# Altium schematic sheet power_supply.SchDoc
size A3; SheetNumber: 1; SheetTotal: 3; SPICEModelCacheKXPDIREM: <root> / <DocumentId>KXPDIREM</DocumentId> / <CacheFrame Number="0"> / <Model Name="amk105cbj106_v-f" Kind="CKT"> / <Text>* AMK105CBJ106_V-F     SPICE MODEL  ( General Type ) / *-------------------------------------------------------------------------------------------------------- / * Model Generated by TAIYO YUDEN Corporation (http://www.ty-top.com) / * Version 1.0 / * TAIYO YUDEN Control No. 170508_140220 / *-------------------------------------------------------------------------------------------------------- / * / * Products Name : Multilayer Ceramic Capacitors / * / * Characteristics : / *     Capacitance : 10 uF , Rated Voltage : 4.0V , TCC : X5R / *     Case Size : 1.0 x 0.5 / 0.039 x 0.02 [mm/inch] , Thickness : 0.5 / 0.02 [mm/inch] / *     (Conditions: Temperature = 25 degC , DC Bias Current/Voltage = 0A / 0V) / * / * Frequency Range : 40Hz - 3GHz / * / * External Node Assignments : / * / *  1  o---| |---o  2 / * / *-------------------------------------------------------------------------------------------------------- / .SubCkt AMK105CBJ106_V-F 1 2 / **************************** / C0 1 110 7.4107u / Cm 1 101 0.96702u / C1 101 102 0.739u / Rc1 101 102 366.75 / C2 102 103 0.24354u / Rc2 102 103 47.641 / C3 103 110 0.14706u / Rc3 103 110 4.2209 / C2m 1 301 1.7678u / C21 301 302 4.7117u / Rc21 301 302 845.67 / C22 302 303 4.121u / Rc22 302 303 734.55 / C23 303 304 4.3096u / Rc23 303 304 562.67 / C24 304 305 2.6992u / Rc24 304 305 26.221 / C25 305 306 1.2642u / Rc25 305 306 46.471 / C26 306 307 2.5266u / Rc26 306 307 22.579 / C27 307 308 0.76655u / Rc27 307 308 4.4337 / C28 308 309 0.64691u / Rc28 308 309 2.6063 / C29 309 110 4901.4p / Rc29 309 110 1.4662 / Rp0 1 110 10Meg / L0 110 120 0.1817n / Lm 120 130 0.19649n / L1 120 121 0.098105n / RL1 121 130 0.12128 / L2 120 122 0.12674n / RL2 122 130 0.26881 / L3 120 123 0.76569n / RL3 123 130 0.47843m / CR 120 124 1.5221u / LR 124 125 0.35836n / RR 125 130 25.315m / CL 130 140 2.9027p / LL 130 140 0.10763n / RL 130 140 26.768 / Rs 140 2 2.766m / **************************** / .ends</Text> / </Model> / </CacheFrame> / </root>
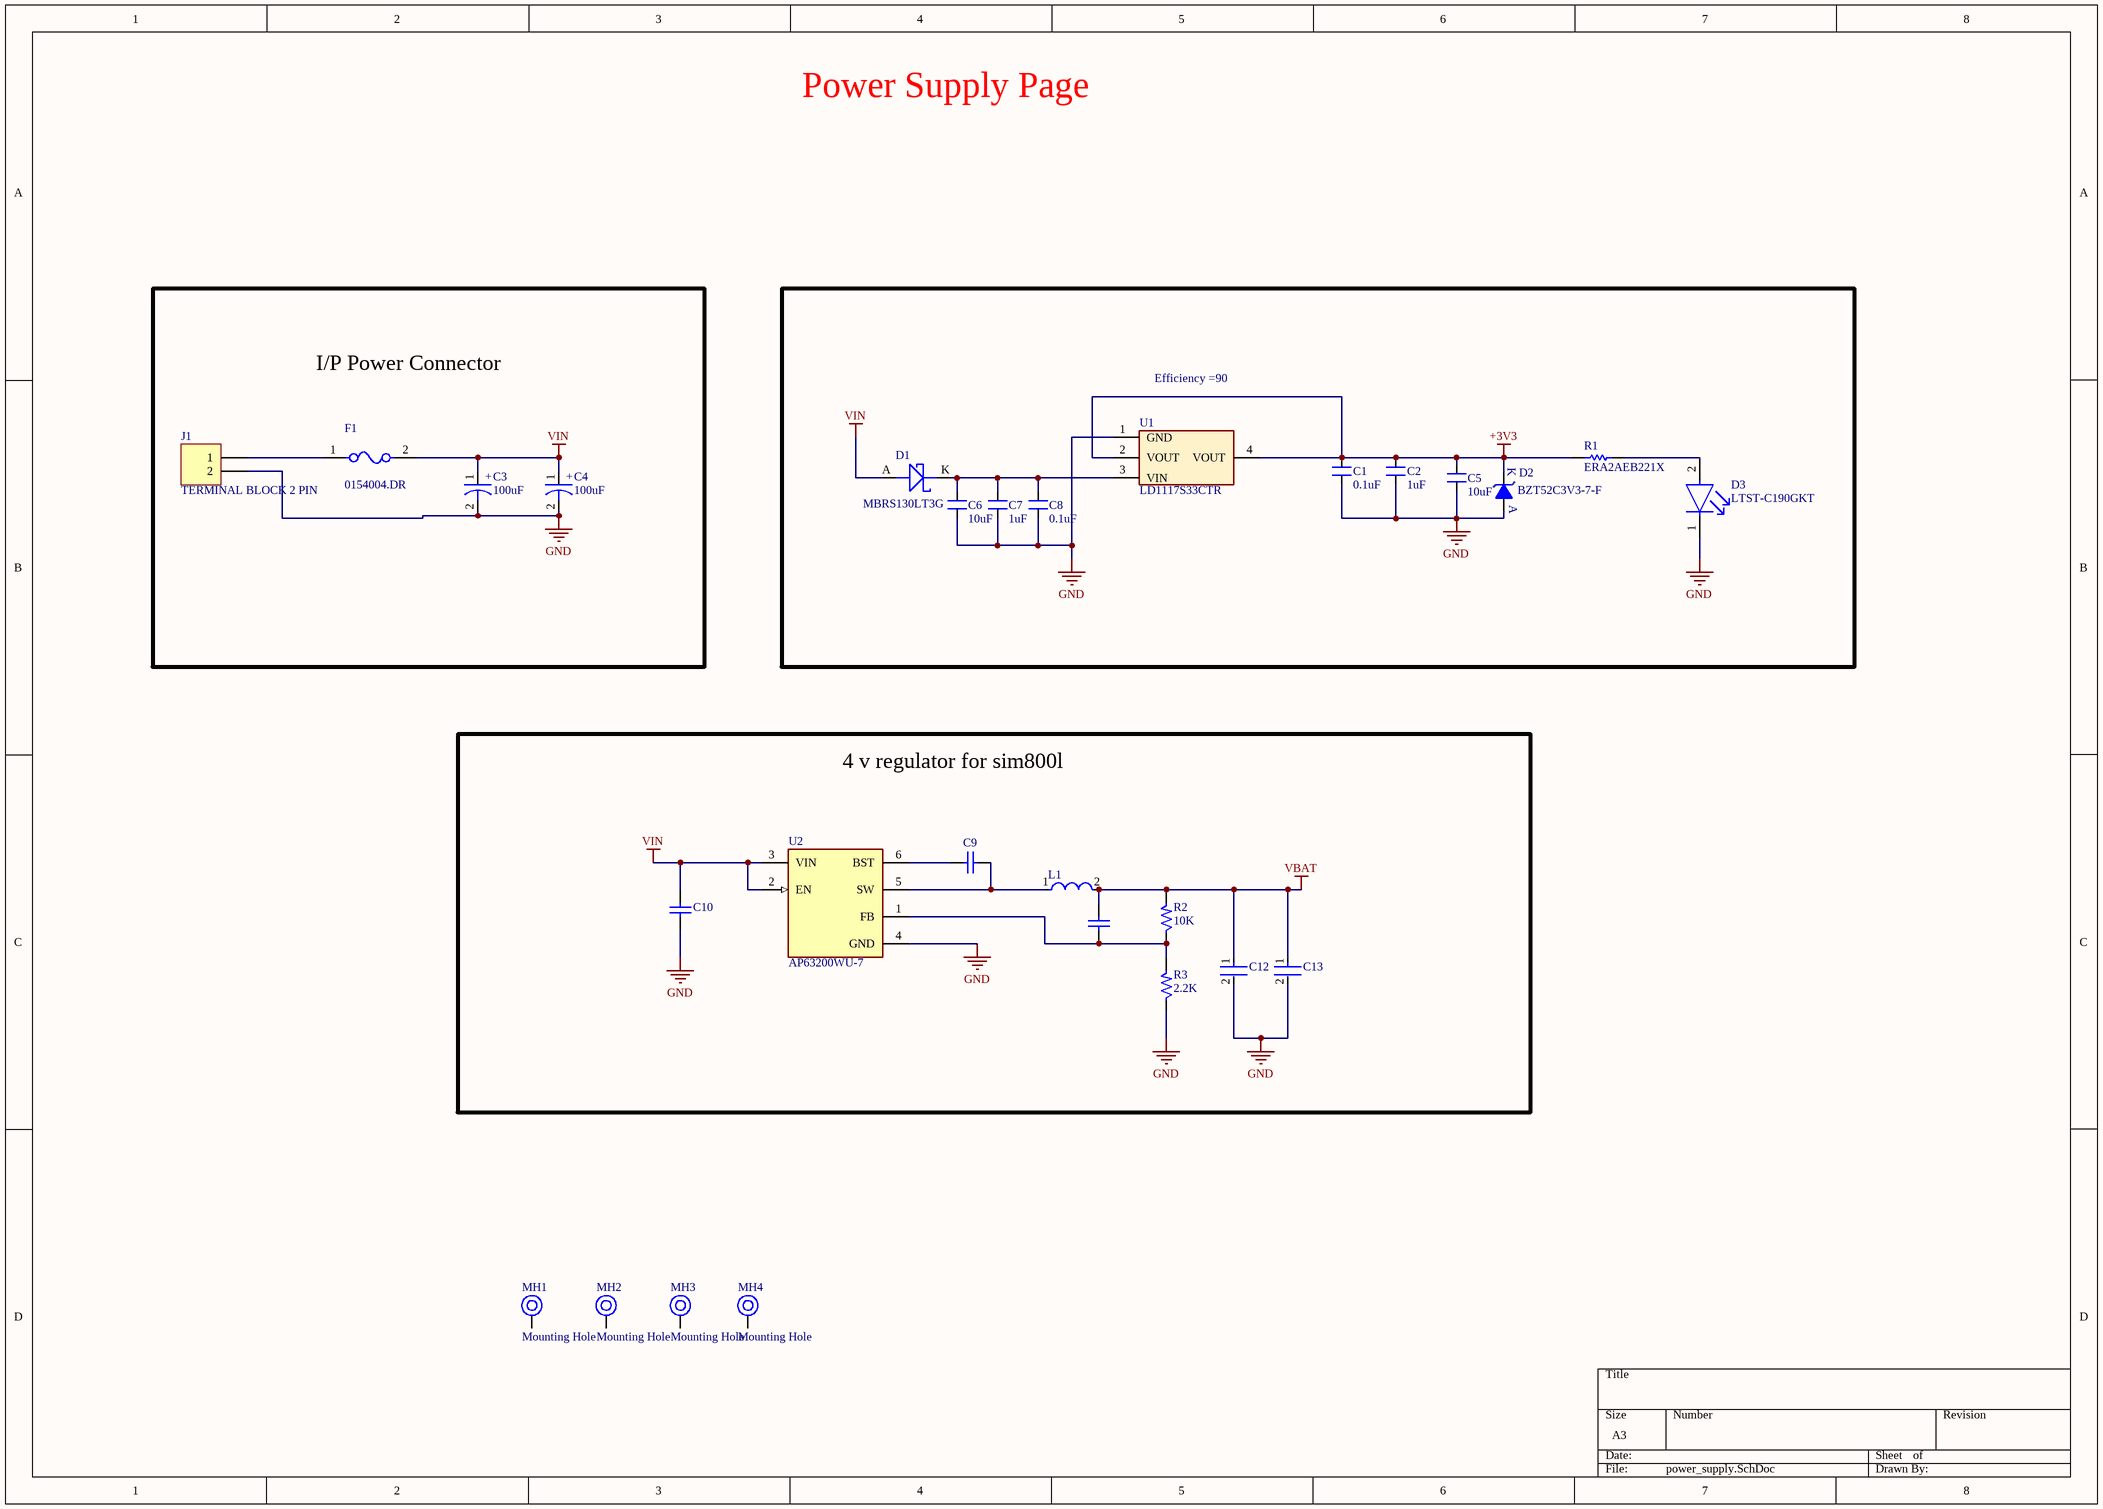
[diagram p0: power_supply.SchDoc]

## Parts
C1  0.1uF  [CAP_0805]
C2  1uF  [CAP_0805]
C3  100uF  [ACAP_P305_D393_H393_RAD]
C4  100uF  [ACAP_P305_D393_H393_RAD]
C5  10uF  [CAP_1206]
C6  10uF  [CAP_1206]
C7  1uF  [CAP_0805]
C8  0.1uF  [CAP_0805]
C9  04026D104KAT2A  [CAPC1005X56X25LL10T15]  (value not drawn)
C10  AMK105CBJ106MV-F  [CAPC0402(1005)60_N]  (value not drawn)
C11  GRM1555C1H101JA01D  [CAPC1005X55X25ML05T10]  (value not drawn)
C12  GRM21BR60J226ME39L  [FP-GRM21B-0_15-IPC_B]  (value not drawn)
C13  GRM21BR60J226ME39L  [FP-GRM21B-0_15-IPC_B]  (value not drawn)
D1  MBRS130LT3G  [DIO_SMB_DO-214AA]
D2  BZT52C3V3-7-F  [DIO_SOD-123]
D3  LTST-C190GKT  [FP-LTST-C190GKT-MFG]
F1  0154004.DR  [FP-0154-MFG]
J1  TERMINAL BLOCK 2 PIN  [CON2_P196_1729128_TH_ST]
L1  MLZ1005M2R2WT000  [FP-MLZ1005-IPC_B]  (value not drawn)
MH1  Mounting Hole  [MOUNTING]
MH2  Mounting Hole  [MOUNTING]
MH3  Mounting Hole  [MOUNTING]
MH4  Mounting Hole  [MOUNTING]
R1  ERA2AEB221X  [RESC1005X40X25LL10T10]
R2  10K  [RES_0603]
R3  2.2K  [RES_0805]
U1  LD1117S33CTR  [SOT223_3]
U2  AP63200WU-7  [FP-TSOT26-MFG]

## Blocks framed on the sheet
I/P Power Connector: C3 C4 F1 J1
Efficiency =90: C1 C2 C5-C8 D1-D3 R1 U1
4 v regulator for sim800l: C9-C13 L1 R2 R3 U2

## Nets
+3V3: C1.2 C2.2 C5.2 D2.K R1.1 U1.2(VOUT) U1.4(VOUT)
GND: C1.1 C2.1 C3.2 C4.2 C5.1 C6.1 C7.1 C8.1 C10.1 C12.2 C13.2 D2.A D3.1(C) J1.2 R3.1 U1.1(GND) U2.4(GND)
VBAT: C11.2 C12.1 C13.1 L1.2 R2.2
VIN: C3.1 C4.1 C10.2 D1.A F1.2 U2.2(EN) U2.3(VIN)
NetC6_2: C6.2 C7.2 C8.2 D1.K U1.3(VIN)
NetC9_1: C9.1 U2.6(BST)
NetC9_2: C9.2 L1.1 U2.5(SW)
NetC11_1: C11.1 R2.1 R3.2 U2.1(FB)
NetD3_2: D3.2(A) R1.2
NetF1_1: F1.1 J1.1

Not connected (* = marked no-connect by the designer): MH1 1; MH2 1; MH3 1; MH4 1

## Notes on the sheet
- Power Supply Page
- (in symbol CAP-P_100uF-50V-20%-RAD) +

## Library data of the parts
C1 C8 = CAP_0.1uF-50V-10%-0805: 0.1µF ±10% 50V Ceramic Capacitor X7R 0805 (2012 Metric); Manufacturer: Samsung; Manufacturer Part Number: CL21B104KBCNNNC; Alternate Part Number-1: NA; Case/Package: 0805; Supplier-1: SIRICOM; Supplier Part Number-1: 0805B104K500CT
C2 C7 = CAP_1uF-50V-5%-0805: 1µF ±5% 50V Ceramic Capacitor X7R 0805 (2012 Metric); Manufacturer: Samsung; Manufacturer Part Number: CC0805JKX7R9BB105; Alternate Part Number-1: 0805F105M500NT; Case/Package: 0805; Supplier-1: SIRICOM; Supplier Part Number-1: CL21B105KBFNNNE
C3 C4 = CAP-P_100uF-50V-20%-RAD: 100µF 50V Aluminum Polymer Capacitor Radial, Can - SMD 28mOhm 4000 Hrs @ 125°C; Manufacturer: Nichicon; Manufacturer Part Number: GYA1H101MCQ1GS; Alternate Part Number-1: VEU101M1HTR-1010; Case/Package: Radial-SMD; Supplier-1: SP ROAD; Supplier Part Number-1: GYA1H101MCQ1GS
C5 C6 = CAP_10uF-50V-10%-1206: 10µF ±10% 50V Ceramic Capacitor X7R 1206 (3216 Metric); Manufacturer: KEMET; Manufacturer Part Number: CL31B106KBHNNNE; Alternate Part Number-1: GRT31CR61H106ME01L; Case/Package: 1206; Supplier-1: SIRICOM; Supplier Part Number-1: CC1206KKX5R9BB106
C9 = CMP-2008-02743-1: Manufacturer: AVX Interconnect / Elco; Part Number: 04026D104KAT2A
C10 = CMP-1034-02139-2: None; Voltage Rating: 4V; Capacitance: 10uF; Dielectric: X5R; Tolerance: 20%; Width: 0.02inch; Halogen Free: Halogen Free; Termination: SMD/SMT; Voltage Rating (DC): 4V; Length: 0.039inch; RoHS Compliant: Yes; Case/Package: 0402; Mount: Surface Mount; Case Code (Imperial): 0402; Min Operating Temperature: -55°C; Packaging: Tape and Reel; Height: 0.5mm; Case Code (Metric): 1005; Max Operating Temperature: 85°C; Series: M; Package Quantity: 1; Thickness: 0.028inch; Construction: Flat
C11 = CMP-2008-03915-1: Manufacturer: Murata; Part Number: GRM1555C1H101JA01D
C12 C13 = CMP-2007-03385-2: Chip Multilayer Ceramic Capacitors for General Purpose, 0805, 22uF, X5R, 15%, 20%, 6.3V; Material: Ceramic; Max Operating Temperature: 85°C; Voltage: 6.3V; Min Operating Temperature: -55°C; Case/Package: 0805; Thickness: 0.053inch; Dielectric: X5R; Packaging: Tape and Reel; Depth: 1.25mm; Termination: SMD/SMT; Voltage Rating (DC): 6.3V; Radiation Hardening: No; Tolerance: 20%; Mount: Surface Mount; Lead Free: Lead Free; Package Quantity: 1; REACH SVHC: No SVHC; Voltage Rating: 6.3V; Capacitance: 22uF; Length: 2mm; Case Code (Imperial): 0805; Case Code (Metric): 2012; Width: 0.049inch; Height: 1.25mm
D1 = DIO-S_445mV-30V-2A-SMB: Diode Schottky 30V 2A Surface Mount SMB; Manufacturer: ON Semiconductor; Alternate Part Number-1: NA; Manufacturer Part Number: MBRS130LT3G; Case/Package: SMB; Supplier-1: ARROW; Supplier Part Number-1: MBRS130LT3G
D2 = DIO-Z_3.3V-500mW-SOD123: Zener Diode 3.3V 500mW ±6% Surface Mount SOD-123; Manufacturer: Diodes Incorporated; Alternate Part Number-1: NA; Manufacturer Part Number: BZT52C3V3-7-F; Case/Package: SOD-123; Supplier-1: Digikey; Supplier Part Number-1: BZT52C3V3-FDICT-ND
D3 = CMP-22017-000005-2: LED GREEN CLEAR CHIP SMD; Dominant Wavelength: 569nm; Reverse Voltage: 5V; Lens Color: Colorless; Viewing Angle: 130°; Voltage: 2V; Forward Current: 30mA; Power Dissipation: 100mW; Luminous Intensity: 6mcd; Number of LEDs: 1; Forward Voltage: 2.1V; Wavelength: 565nm; Test Current: 10mA; Min Operating Temperature: -55°C; Lens Style: Clear; Mount: Surface Mount; Width: 0.8mm; Packaging: Tape and Reel; Lens Transparency: Clear; Case Code (Metric): 1608; Depth: 0.8mm; Case Code (Imperial): 0603; Case/Package: 0603; Number of Pins: 2; Max Operating Temperature: 85°C; Lead Free: Lead Free; Number of Elements: 1; Length: 1.6mm; Height: 0.8mm; Package Quantity: 1; Power Rating: 100mW; Radiation Hardening: No; Illumination Color: Green; Color: Green
F1 = CMP-08605-000003-1: FUSE BRD MNT 4A 125VAC/VDC 2SMD; Manufacturer: Littelfuse; Fuse Blow Speed: Fast; Max Fuse Ac Voltage: 125V; Lead Free: Yes; Device Class L3: unset; Manufacturer Part Number: 0154004.DR; Device Class L2: Fuses; Package: 0154; ComponentLink2Description: Datasheet; Temperature Range Low: -55°C; Temperature Range High: +125°C; Device Class L1: Circuit Protection; Height: 3.81mm; Temperature: -55°C to +125°C; Mouser Description: Surface Mount Fuses Fuseblock w/ fuse 4A OMNI BLOK 154; Automotive: No; Digikey Description: FUSE BRD MNT 4A 125VAC/VDC 2SMD; RoHS: TRUE; Category: Fuse; Fuse Current: 4A; Max Fuse Dc Voltage: 125V; ComponentLink2URL: https://www.littelfuse.com/~/media/electronics/datasheets/fuses/littelfuse_fuse_154_154t_154l_154tl_datasheet.pdf.pdf; Octopart: https://octopart.com/0154004.dr-littelfuse-565861
J1 = CON-TB_2X1-196-ST-TH: 2 Pins, 1 Row 5mm Pitch, straight Connector, male; Manufacturer: Phoenix Contact; Manufacturer Part Number: MKDSN1,5/2; Alternate Part Number-1: NA; Case/Package: TH-CON; Supplier-1: SP ROAD; Supplier Part Number-1: MKDSN1,5/2
L1 = CMP-08253-000201-1: Shielded Multilayer Inductor 2.2uH ±20% 350mA 715mΩ SMD 0402; Core Material: Ferrite; Saturation Current: 60mA; DC Resistance (DCR): 715mR; Self Resonant Frequency: 120MHz; Test Frequency: 2MHz; RoHS Compliant: Yes; Tolerance: 20%; Current Rating: 350mA; Min Operating Temperature: -55°C; Case Code (Imperial): 0402; Length: 0.039inch; Case/Package: 0402; Inductance: 2.2uH; Mount: Surface Mount; Package Quantity: 10000; Shielding: Shielded; Width: 0.02inch; Case Code (Metric): 1005; Height - Seated (Max): 0.022inch; Max Operating Temperature: 125°C; Packaging: Tape and Reel
MH1-MH4 = MH_3.5H_6D: Manufacturer Part Number: NA; Case/Package: TH; Manufacturer: NA; Supplier-1: NA; Supplier Part Number-1: NA; Alternate Part Number-1: NA
R1 = CMP-2002-05880-1: Manufacturer: Panasonic; Part Number: ERA2AEB221X
R2 = RES_10K-0.1W-1%-0603: 10 kOhms ±1% 0.1W, 1/10W Chip Resistor 0603 (1608 Metric) Automotive AEC-Q200 Thick Film; Manufacturer: Walsin; Manufacturer Part Number: WR06X1002FTL; Alternate Part Number-1: 0603WAJ0103T5E; Case/Package: 0603; Supplier-1: SIRICOM; Supplier Part Number-1: WR06X1002FTL
R3 = RES_2.2K-0.125W-1%-0805: 2.2 kOhms ±1% 0.125W, 1/8W Chip Resistor 0805 (2012 Metric) Thick Film; Manufacturer: Stackpole Electronics; Manufacturer Part Number: CRG0805F2K2; Alternate Part Number-1: CR0805F82201G; Case/Package: 0805; Supplier-1: SIRICOM; Supplier Part Number-1: WR08X2201FTL
U1 = REG_15V-3.3V-0.9A-12W-SOT223: Linear Voltage Regulator IC 1 Output 800mA SOT-223; Manufacturer: STMicroelectronics; Alternate Part Number-1: NA; Manufacturer Part Number: LD1117S33CTR; Case/Package: SOT223; Supplier-1: SP ROAD; Supplier Part Number-1: LD1117S33CTR
U2 = CMP-12757-000010-1: IC REG BUCK ADJUSTABLE 2A TSOT26; Manufacturer: Diodes Inc.; Switching Frequency: 500kHz; Max Supply Voltage: 32V; Number Of Outputs: 1; Nominal Supply Current: 22uA; Min Supply Voltage: 3.8V; Output Type: AdjustableProgrammable; Max Junction Temp: +160°C; Standoff Height: 0.01mm; Octopart: https://octopart.com/ap63200wu-7-diodes+inc.-98099548; Height: 1mm; Temperature Range Low: -40°C; Output Current: 2A; ComponentLink2URL: https://www.diodes.com/assets/Datasheets/AP63200-AP63201-AP63203-AP63205.pdf; Switching Topology: Buck; Automotive: No; Device Class L1: Integrated Circuits (ICs); Ipc Land Pattern Name: SOT95P280X100-6; Package: TSOT26; Temperature Range High: +85°C; RoHS: TRUE; Ambient Temperature Range High: +85°C; Device Class L3: Voltage Regulators - Switching; Temperature: -40°C to +85°C; Device Class L2: Power Management ICs; Footprint Url: https://www.diodes.com/assets/Package-Files/TSOT26.pdf; Mouser Description: AP63200 Series 1.2 V 2 A Adjustable Synchronous Buck Converter - TSOT-26; Category: IC; ComponentLink2Description: Datasheet; Digikey Description: IC REG BUCK ADJUSTABLE 2A TSOT26; Lead Free: Yes; Ambient Temperature Range Low: -40°C; Manufacturer Part Number: AP63200WU-7